# EAGLE design ECE445-Transmitter-Schematic (EAGLE 7.5.0)
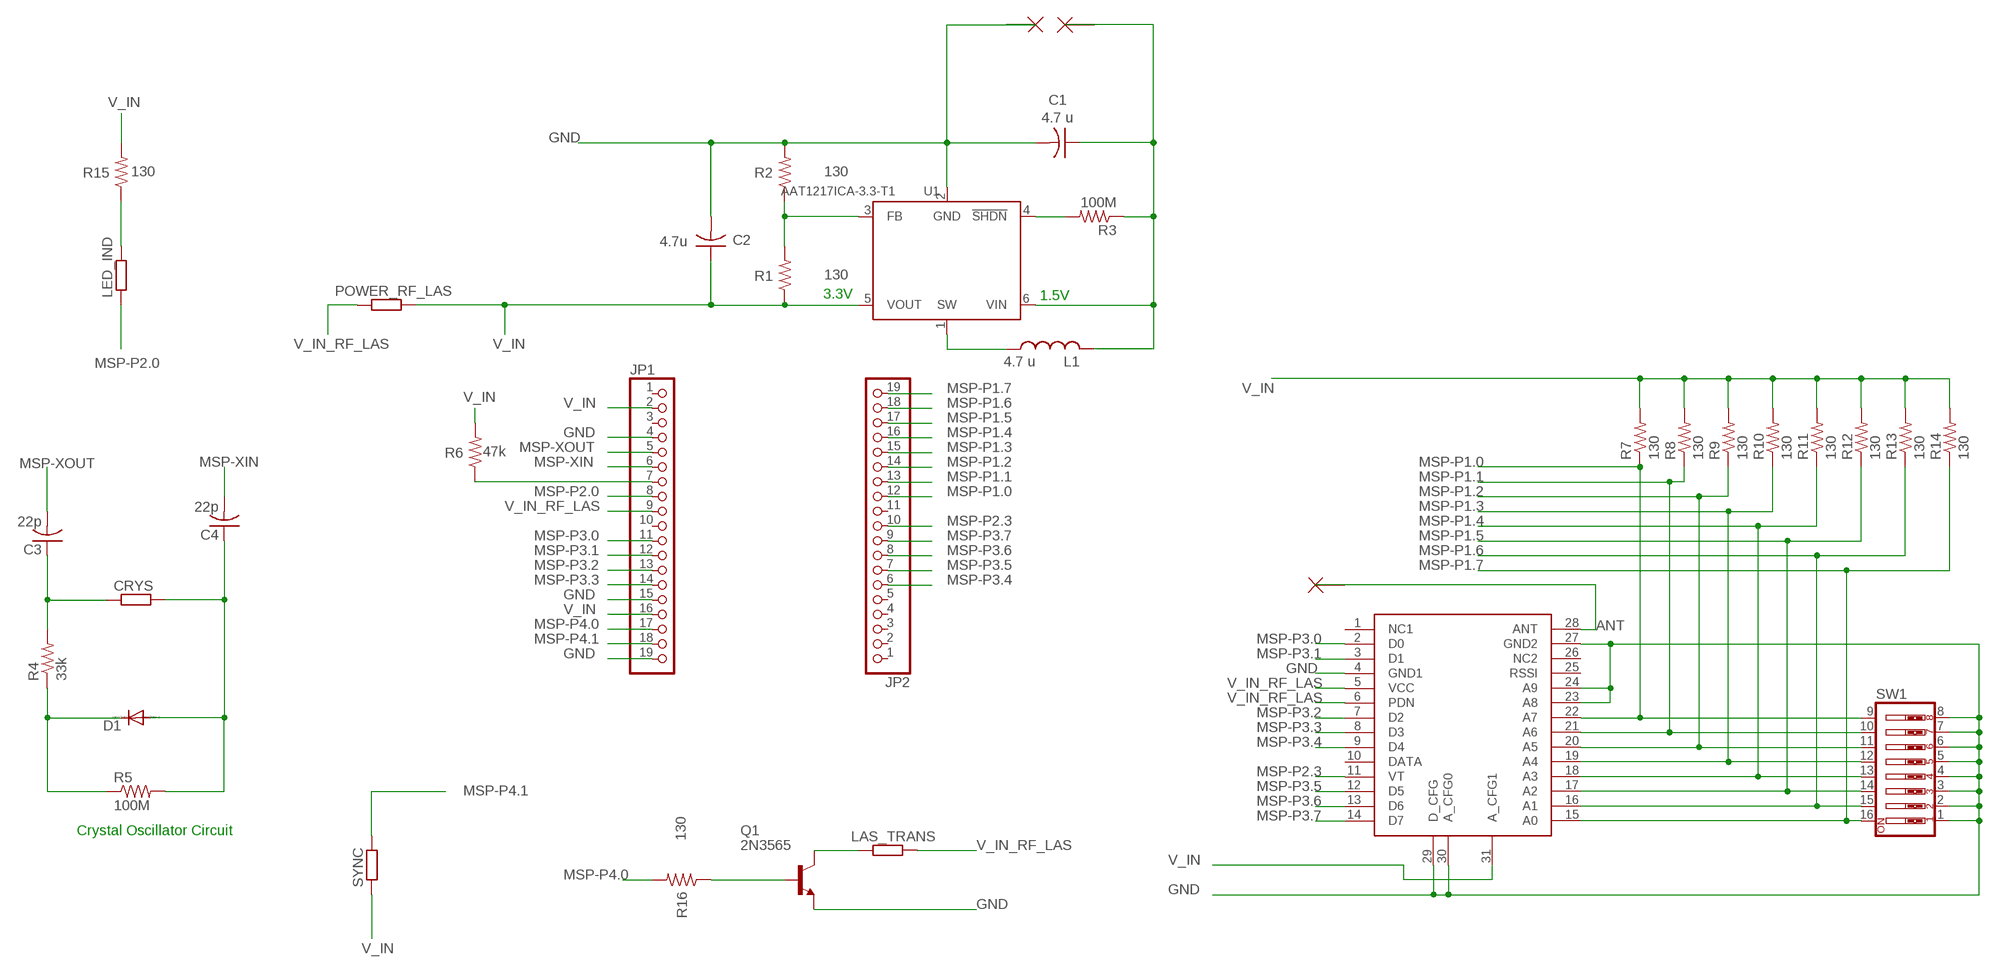
[diagram p0: schematic, sheet 1]

## Parts
C1  4.7 u  C-US025-024X044  [C025-024X044]
C2  4.7u  C-US025-024X044  [C025-024X044]
C3  22p  C-US025-024X044  [C025-024X044]
C4  22p  C-US025-024X044  [C025-024X044]
CRYS  R-EU_0204/5  [0204/5]
D1  1N4004  [DO41-10]
JP1  PINHD-1X19  [1X19]
JP2  PINHD-1X19  [1X19]
L1  4.7 u  L-US0204/5  [0204/5]
LAS_TRANS  R-EU_0204/5  [0204/5]
LED_IND  R-EU_0204/5  [0204/5]
POWER_RF_LAS  R-EU_0204/5  [0204/5]
Q1  2N3565  [TO92]
R1  130  R-US_0204/5  [0204/5]
R2  130  R-US_0204/5  [0204/5]
R3  100M  R-US_0204/2V  [0204V]
R4  33k  R-US_0204/2V  [0204V]
R5  100M  R-US_0204/2V  [0204V]
R6  47k  R-US_0204/5  [0204/5]
R7  130  R-US_0204/5  [0204/5]
R8  130  R-US_0204/5  [0204/5]
R9  130  R-US_0204/5  [0204/5]
R10  130  R-US_0204/5  [0204/5]
R11  130  R-US_0204/5  [0204/5]
R12  130  R-US_0204/5  [0204/5]
R13  130  R-US_0204/5  [0204/5]
R14  130  R-US_0204/5  [0204/5]
R15  130  R-US_0204/5  [0204/5]
R16  130  R-US_0204/5  [0204/5]
SW1  SW_DIP-8  [EDG-08]
SYNC  R-EU_0204/5  [0204/5]
U1  AAT1217ICA-3.3-T1  [TSOT-23-6]
U$1  KH3-RXM-LINX-315  [KH3-RXM-LINX-315]
U$2  NO_CONNECT  [NO_CONNECT]
U$3  NO_CONNECT  [NO_CONNECT]
U$4  NO_CONNECT  [NO_CONNECT]

## Nets
ANT: U$1.28(ANT) U$4.P$1(NC)
GND: C1.2 C2.2 JP1.4 JP1.15 JP1.19 Q1.3(E) R2.2 SW1.1 SW1.2 SW1.3 SW1.4 SW1.5 SW1.6 SW1.7 SW1.8 U1.2(GND) U$1.4(GND1) U$1.23(A8) U$1.24(A9) U$1.27(GND2) U$1.29(D_CFG) U$1.30(A_CFG0) U$2.P$1(NC)
MSP-P1.0: JP2.12 R7.1 SW1.9 U$1.22(A7)
MSP-P1.1: JP2.13 R8.1 SW1.10 U$1.21(A6)
MSP-P1.2: JP2.14 R9.1 SW1.11 U$1.20(A5)
MSP-P1.3: JP2.15 R10.1 SW1.12 U$1.19(A4)
MSP-P1.4: JP2.16 R11.1 SW1.13 U$1.18(A3)
MSP-P1.5: JP2.17 R12.1 SW1.14 U$1.17(A2)
MSP-P1.6: JP2.18 R13.1 SW1.15 U$1.16(A1)
MSP-P1.7: JP2.19 R14.1 SW1.16 U$1.15(A0)
MSP-P2.0: JP1.8 LED_IND.1
MSP-P2.3: JP2.10 U$1.11(VT)
MSP-P3.0: JP1.11 U$1.2(D0)
MSP-P3.1: JP1.12 U$1.3(D1)
MSP-P3.2: JP1.13 U$1.7(D2)
MSP-P3.3: JP1.14 U$1.8(D3)
MSP-P3.4: JP2.6 U$1.9(D4)
MSP-P3.5: JP2.7 U$1.12(D5)
MSP-P3.6: JP2.8 U$1.13(D6)
MSP-P3.7: JP2.9 U$1.14(D7)
MSP-P4.0: JP1.17 R16.2
MSP-P4.1: JP1.18 SYNC.2
MSP-XIN: C4.2 JP1.6
MSP-XOUT: C3.2 JP1.5
N$1: LAS_TRANS.1 Q1.1(C)
N$2: L1.1 U1.1(SW)
N$4: C1.1 L1.2 R3.1 U1.6(VIN) U$3.P$1(NC)
N$6: C3.1 CRYS.1 R4.2
N$7: Q1.2(B) R16.1
N$8: D1.C R4.1 R5.1
N$11: R1.2 R2.1 U1.3(FB)
N$12: C4.1 CRYS.2 D1.A R5.2
N$13: JP1.7 R6.1
N$19: R3.2 U1.4(!SHDN)
N$31: LED_IND.2 R15.1
V_IN: C2.1 JP1.2 JP1.16 POWER_RF_LAS.2 R1.1 R6.2 R7.2 R8.2 R9.2 R10.2 R11.2 R12.2 R13.2 R14.2 R15.2 SYNC.1 U1.5(VOUT) U$1.31(A_CFG1)
V_IN_RF_LAS: JP1.9 LAS_TRANS.2 POWER_RF_LAS.1 U$1.5(VCC) U$1.6(PDN)
Unconnected: JP1.1 JP1.3 JP1.10 JP2.1 JP2.2 JP2.3 JP2.4 JP2.5 JP2.11 U$1.1(NC1) U$1.10(DATA) U$1.25(RSSI) U$1.26(NC2)

## Notes on the sheet
- 3.3V | 1.5V
- Crystal Oscillator Circuit

## Library data of the parts
C1-C4 = rcl:C-US: CAPACITOR, American symbol
CRYS LAS_TRANS LED_IND POWER_RF_LAS SYNC = rcl:R-EU_: RESISTOR, European symbol
D1 = diode:1N4004: DIODE general purpose rectifier, 1 A
JP1 JP2 = pinhead:PINHD-1X19: PIN HEADER
L1 = rcl:L-US: INDUCTOR, American symbol
Q1 = transistor-npn:2N3565: NPN Transistor
R1-R16 = rcl:R-US_: RESISTOR, American symbol
SW1 = special:SW_DIP-8: DIP SWITCH
U1 = Skyworks:AAT1217
U$1 = KH3-RXM-LINX-315:KH3-RXM-LINX-315
U$2-U$4 = NO_CONNECT:NO_CONNECT

## Board
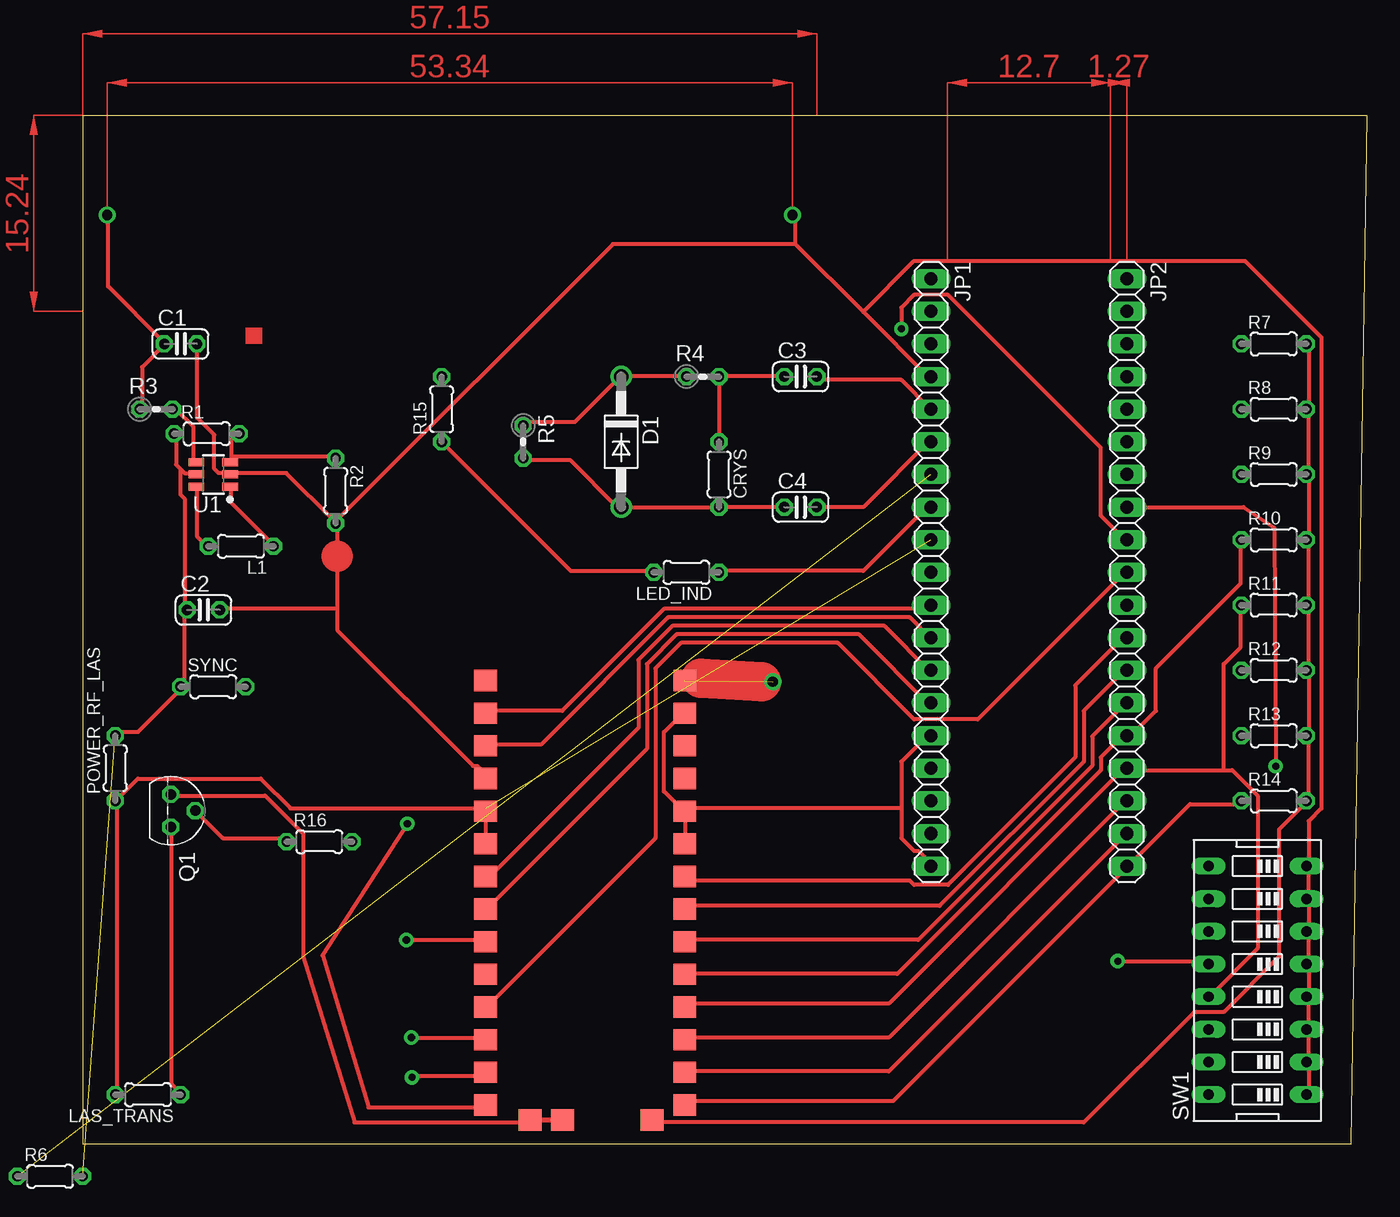
[diagram p1: board, top side]
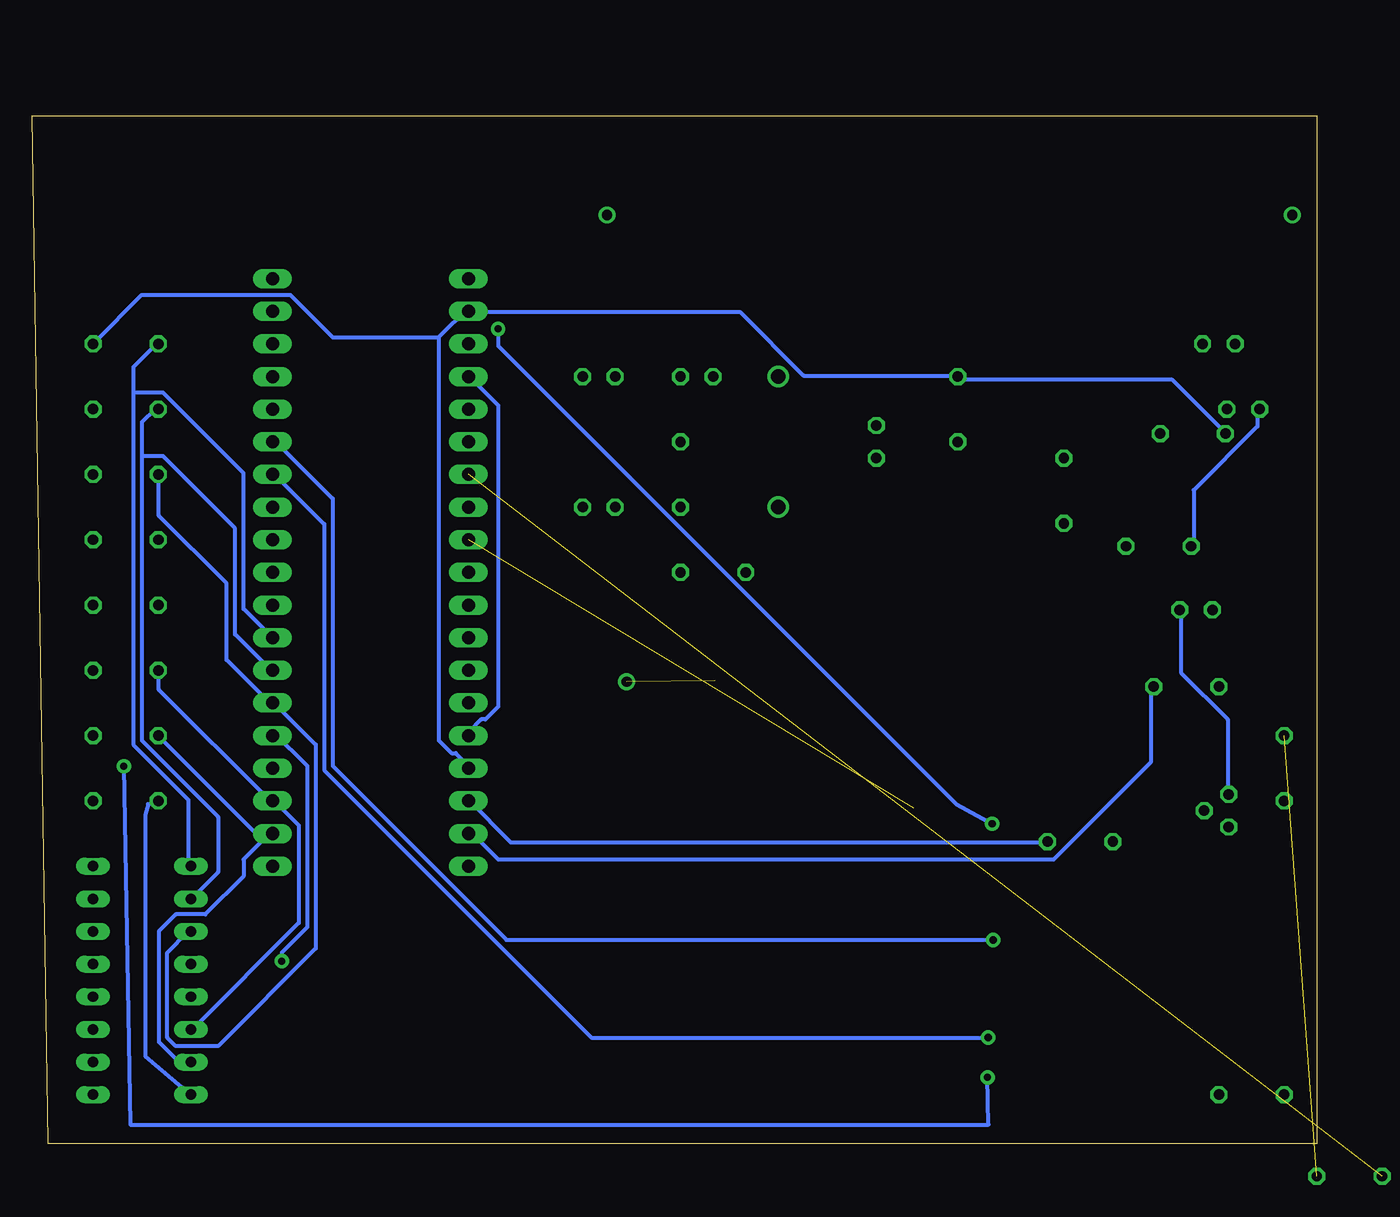
[diagram p2: board, bottom side, seen from below]

Size 100 x 80 mm. Coordinates in mm from the lower left corner, seen from the top.
Outline: 0,0 98.73,0 100,80 0,80 0,0
Copper layers (1*16): Top 0.035mm / dielectric 1.5mm / Bottom 0.035mm
Design rules "MWSEagleDesignRules2": minimum track width 13mil, minimum drill 22mil, track to track 13mil, track to pad 13mil, pad to pad 13mil, via to via 13mil, smd to smd 8mil, copper to edge 40mil, drill to drill 8mil, minimum pad ring 10mil, minimum via ring 8mil, stop-mask expansion 4mil, vias tented up to drill 0mil, thermal gap 10mil
vRestrict: area 0,64.8 to 57.1,80; area 31.9,2.5 to 47.1,36.8; area 88.3,1.3 to 94.6,24.1; area 67.3,20.3 to 80,68.6

### Footprints (pad centres in the part's own frame; a part is rotated, then mirrored left to right if it is on the bottom)
C025-024X044 = drill 0.813 octagon: 1 -1.27,0; 2 1.27,0
0204/5 = drill 0.813 octagon: 1 -2.54,0; 2 2.54,0
DO41-10 = drill 1.118: A 5.08,0; C -5.08,0
1X19 = drill 1.016 long: 1 -22.86,0; 2 -20.32,0; 3 -17.78,0; 4 -15.24,0; 5 -12.7,0; 6 -10.16,0; 7 -7.62,0; 8 -5.08,0; 9 -2.54,0; 10 0,0; 11 2.54,0; 12 5.08,0; 13 7.62,0; 14 10.16,0; 15 12.7,0; 16 15.24,0; 17 17.78,0; 18 20.32,0; 19 22.86,0
TO92 = drill 0.813 octagon: 1 1.27,0; 2 0,1.905; 3 -1.27,0
0204V = drill 0.813 octagon: 1 -1.27,0; 2 1.27,0
EDG-08 = drill 0.813 long: 1 -8.89,-3.81; 2 -6.35,-3.81; 3 -3.81,-3.81; 4 -1.27,-3.81; 5 1.27,-3.81; 6 3.81,-3.81; 7 6.35,-3.81; 8 8.89,-3.81; 9 8.89,3.81; 10 6.35,3.81; 11 3.81,3.81; 12 1.27,3.81; 13 -1.27,3.81; 14 -3.81,3.81; 15 -6.35,3.81; 16 -8.89,3.81
TSOT-23-6 = smd 1.22 x 0.62: 1 -1.31,0.95; 2 -1.31,0; 3 -1.31,-0.95; 4 1.31,-0.95; 5 1.31,0; 6 1.31,0.95
KH3-RXM-LINX-315 = smd 1.78 x 1.65: 1 -8,19.52; 2 -8,16.98; 3 -8,14.44; 4 -8,11.9; 5 -8,9.36; 6 -8,6.82; 7 -8,4.28; 8 -8,1.74; 9 -8,-0.8; 10 -8,-3.34; 11 -8,-5.88; 12 -8,-8.42; 13 -8,-10.96; 14 -8,-13.5; 15 7.49,-13.5; 16 7.49,-10.96; 17 7.49,-8.42; 18 7.49,-5.88; 19 7.49,-3.34; 20 7.49,-0.8; 21 7.49,1.74; 22 7.49,4.28; 23 7.49,6.82; 24 7.49,9.36; 25 7.49,11.9; 26 7.49,14.44; 27 7.49,16.98; 28 7.49,19.52; 29 -4.55,-14.67; 30 -2.01,-14.67; 31 4.95,-14.67
NO_CONNECT = drill 0.8: P$1 0,0

### Placement (x,y rotation side)
C1  7.62,62.23 0 top
C2  9.4,41.53 0 top
C3  55.88,59.69 0 top
C4  55.88,49.53 0 top
CRYS  49.53,52.07 270 top
D1  41.91,54.61 270 top
JP1  66.04,44.45 270 top
JP2  81.28,44.45 270 top
L1  12.32,46.48 180 top
LAS_TRANS  5.08,3.81 180 top
LED_IND  46.99,44.45 180 top
POWER_RF_LAS  2.54,29.21 90 top
Q1  6.86,25.91 270 top
R1  9.65,55.24 0 top
R2  19.68,50.8 270 top
R3  5.71,57.15 0 top
R4  48.26,59.69 0 top
R5  34.29,54.61 270 top
R6  -2.54,-2.54 0 top
R7  92.71,62.23 0 top
R8  92.71,57.15 0 top
R9  92.71,52.07 0 top
R10  92.71,46.99 0 top
R11  92.71,41.91 0 top
R12  92.71,36.83 0 top
R13  92.71,31.75 0 top
R14  92.71,26.67 0 top
R15  27.94,57.15 90 top
R16  18.41,23.5 0 top
SW1  91.44,12.7 90 top
SYNC  10.16,35.56 0 top
U1  10.16,52.07 180 top
U$1  39.37,16.51 0 top
U$2  55.24,72.26 0 top
U$3  1.91,72.26 0 top
U$4  53.72,35.94 0 top

### Tracks (layer width: path | path; a pad name or v marks a point on that pad's centre or on a via)
ANT  (1 unrouted)
GND
  Top 0.33: U$1.29 34.67,1.65 21.16,1.65 17.17,14.53 17.17,24.11 14.2,27.08 6.93,27.08 Q1.3 | R2.2 19.48,48.54 15.85,52.17 11.56,52.17 U1.2 11.23,52.17 10.57,52.17 10.24,52.5 10.24,55.14 8.91,56.46 8.91,62.08 C1.2 | 19.81,41.6 19.81,48.21 R2.2 | 19.81,41.6 19.81,39.95 30.38,29.39 30.71,29.39 31.37,28.73 U$1.4 | 19.81,41.6 10.9,41.6 C2.2 | U$1.23 46.89,23.44 46.89,25.76 U$1.24 | U$1.27 46.56,33.35 45.24,32.03 45.24,27.41 46.56,26.09 U$1.24 | 63.73,26.09 63.73,29.72 66.04,32.03 JP1.15 | 63.73,26.09 63.73,23.77 64.72,22.78 65.05,22.78 66.04,21.79 JP1.19 | 63.73,26.09 46.89,26.09 U$1.24 | 95.43,16.51 95.43,18.82 SW1.7 95.43,19.15 95.43,21.46 SW1.8 95.43,21.79 95.43,25.09 96.42,26.09 96.42,62.74 90.47,68.68 64.72,68.68 60.76,64.72 | SW1.1 95.43,3.96 95.43,6.27 SW1.2 95.43,6.6 95.43,8.59 SW1.3 95.43,8.91 95.43,11.23 SW1.4 95.43,11.56 95.43,13.87 SW1.5 95.43,14.2 95.43,16.51 | 95.43,16.51 SW1.6 | 55.47,70 55.47,71.98 U$2.P$1 | 60.76,64.72 66.04,59.44 JP1.4 | 60.76,64.72 55.47,70 | 55.47,70 41.27,70 19.81,48.54 R2.2
  Top 0.406: U$1.29 U$1.30
  Bottom 0.33: Q1.3 6.93,27.41 6.93,33.02 10.57,36.65 10.57,41.27 C2.2 | JP1.15 66.04,32.03 65.05,33.02 64.72,33.02 63.73,34.01 63.73,57.45 66.04,59.77 JP1.4
MSP-P1.0
  Top 0.33: U$1.22 46.89,20.47 64.39,20.47 64.72,20.14 67.36,20.14 77.27,30.05 77.27,35.66 81.23,39.62 JP2.12
  Bottom 0.33: 92.13,58.45 92.13,60.43 90.47,62.08 R7.1 | 92.13,58.45 92.13,31.04 87.83,26.75 87.83,21.79 SW1.9 | 92.13,58.45 89.81,58.45 83.54,52.17 83.54,41.6 81.56,39.62 JP2.12
MSP-P1.1
  Top 0.33: U$1.21 46.89,18.49 66.7,18.49 77.93,29.72 77.93,33.68 81.23,36.98 JP2.13
  Bottom 0.33: 91.47,53.49 91.47,56.13 90.47,57.12 R8.1 | 91.47,53.49 91.47,31.37 85.52,25.43 85.52,21.13 87.5,19.15 SW1.10 | 91.47,53.49 89.81,53.49 84.2,47.88 84.2,39.62 81.56,36.98 JP2.13
MSP-P1.2
  Top 0.33: U$1.20 46.89,15.85 65.05,15.85 78.59,29.39 78.59,31.7 81.23,34.34 JP2.14
  Bottom 0.33: SW1.11 87.83,16.51 89.48,14.86 89.48,8.26 88.82,7.59 85.52,7.59 77.93,15.19 77.93,31.04 81.23,34.34 JP2.14 81.56,34.34 84.86,37.64 84.86,43.59 90.14,48.87 90.14,51.84 R9.1
MSP-P1.3  (via drill 0.56)
  Top 0.33: U$1.19 46.89,13.21 63.4,13.21 79.25,29.06 79.25,30.05 81.23,32.03 JP2.15 81.56,31.7 83.54,33.68 83.54,36.98 90.14,43.59 90.14,46.89 R10.1 | v80.57,14.2 87.5,14.2 SW1.12
  Bottom 0.33: v80.57,14.2 80.57,14.86 78.59,16.84 78.59,29.39 81.23,32.03 JP2.15
MSP-P1.4
  Top 0.33: U$1.18 46.89,10.9 62.74,10.9 81.23,29.39 JP2.16 81.56,29.06 88.82,29.06 | 88.82,29.06 89.48,29.06 91.47,27.08 91.47,15.19 87.83,11.56 SW1.13 | 88.82,29.06 88.82,37.31 90.14,38.63 90.14,41.6 R11.1
MSP-P1.5
  Top 0.33: U$1.17 46.89,8.26 62.74,8.26 81.23,26.75 JP2.17
  Bottom 0.33: SW1.14 87.5,8.91 79.25,17.17 79.25,24.77 81.23,26.75 JP2.17 81.56,26.75 90.14,35.33 90.14,36.65 R12.1
MSP-P1.6
  Top 0.33: U$1.16 46.89,5.61 62.74,5.61 81.23,24.11 JP2.18
  Bottom 0.33: 81.89,23.77 81.56,24.11 JP2.18 81.89,23.77 | 81.89,23.77 83.54,22.12 83.54,20.8 86.51,17.83 88.82,17.83 90.14,16.51 90.14,7.92 88.82,6.6 87.83,6.6 SW1.15 | 81.89,23.77 82.22,23.77 90.14,31.7 R13.1
MSP-P1.7
  Top 0.33: U$1.15 46.89,3.3 63.07,3.3 81.23,21.46 JP2.19 81.56,21.79 86.18,26.42 90.14,26.42 R14.1
  Bottom 0.33: SW1.16 87.83,3.96 91.19,6.81 91.19,25.58 90.98,26.42 R14.1
MSP-P2.0
  Top 0.33: JP1.8 65.71,49.53 60.76,44.58 49.53,44.58 LED_IND.1
MSP-P2.3
  Top 0.33: U$1.11 31.7,10.9 44.58,23.77 44.58,36.98 46.56,38.96 58.78,38.96 64.72,33.02 69.67,33.02 81.23,44.58 JP2.10
MSP-P3.0
  Top 0.33: U$1.2 31.7,33.68 37.31,33.68 45.24,41.6 66.04,41.6 JP1.11
MSP-P3.1
  Top 0.33: U$1.3 31.7,31.04 35.66,31.04 45.57,40.95 64.39,40.95 66.04,39.29 JP1.12
MSP-P3.2
  Top 0.33: U$1.7 31.7,20.8 43.26,32.36 43.26,37.64 45.9,40.28 62.41,40.28 66.04,36.65 JP1.13
MSP-P3.3
  Top 0.33: U$1.8 31.7,18.49 43.92,30.71 43.92,37.31 46.23,39.62 60.43,39.62 66.04,34.01 JP1.14
MSP-P3.4  (via drill 0.56)
  Top 0.33: v25.2,15.85 31.37,15.85 U$1.9
  Bottom 0.33: v25.2,15.85 63.07,15.85 76.61,29.39 76.61,50.19 81.23,54.81 JP2.6
MSP-P3.5  (via drill 0.56)
  Top 0.33: v25.58,8.26 31.37,8.26 U$1.12
  Bottom 0.33: v25.58,8.26 56.46,8.26 77.27,29.06 77.27,48.21 81.23,52.17 JP2.7
MSP-P3.6  (via drill 0.56)
  Top 0.33: v25.63,5.16 25.63,5.28 31.7,5.28 U$1.13 | v92.86,29.36 92.73,47.93 90.37,49.53 JP2.8
  Bottom 0.33: v25.63,5.16 25.55,1.47 92.35,1.47 v92.86,29.36
MSP-P3.7  (via drill 0.56)
  Top 0.33: v25.27,24.89 18.67,14.66 22.25,2.82 30.58,2.82 31.37,3.3 U$1.14 | v63.73,63.4 63.73,65.05 64.72,66.04 67.36,66.04 79.25,54.15 79.25,48.87 81.23,46.89 JP2.9
  Bottom 0.33: v25.27,24.89 28.07,26.42 63.73,62.08 v63.73,63.4
MSP-P4.0
  Bottom 0.33: R16.2 21.13,23.44 62.74,23.44 66.04,26.75 JP1.17
MSP-P4.1
  Bottom 0.33: SYNC.2 12.88,35.33 12.88,29.72 20.47,22.12 63.73,22.12 66.04,24.43 JP1.18
MSP-XIN
  Top 0.33: C4.2 60.76,49.53 66.04,54.81 JP1.6
MSP-XOUT
  Top 0.33: C3.2 57.45,59.44 63.73,59.44 66.04,57.12 JP1.5
N$1
  Top 0.33: Q1.1 6.93,24.43 6.93,4.62 7.59,3.96 LAS_TRANS.1
N$2
  Top 0.33: U1.1 11.56,50.85 11.56,49.86 14.86,46.56 L1.1
N$4
  Top 0.33: U1.6 8.91,50.85 8.91,47.22 9.58,46.56 L1.2 | U$3.P$1 1.98,71.98 1.98,66.7 6.27,62.41 C1.1 6.27,62.08 4.62,60.43 4.62,57.45 R3.1
  Bottom 0.33: L1.2 9.58,46.56 9.58,50.85 4.62,55.8 4.62,57.12 R3.1
N$6
  Top 0.33: CRYS.1 R4.2 49.53,59.77 54.48,59.77 C3.1
N$7
  Top 0.33: Q1.2 10.9,23.77 15.85,23.77 R16.1
N$8
  Top 0.33: R5.1 34.34,56.13 38.3,56.13 41.6,59.44 D1.C 41.94,59.77 46.89,59.77 R4.1
N$10
  Top 3.09: 48.13,36.2 52.83,35.94
N$11
  Top 0.33: 11.56,53.49 11.56,54.81 11.89,55.14 R1.2 | 11.56,53.49 11.56,53.16 U1.3 | 11.56,53.49 19.48,53.49 R2.1
N$12
  Top 0.33: C4.1 CRYS.2 D1.A 41.6,49.53 37.97,53.16 34.34,53.16 R5.2
N$13  (1 unrouted)
N$19
  Top 0.33: U1.4 8.59,53.16 8.59,55.8 7.26,57.12 R3.2
N$31
  Top 0.33: R15.1 37.97,44.58 44.25,44.58 LED_IND.2
V_IN  (1 unrouted)
  Top 0.33: POWER_RF_LAS.2 2.64,32.03 4.29,32.03 7.59,35.33 SYNC.1 7.92,35.66 7.92,41.27 C2.1 7.92,41.6 7.92,50.19 7.59,50.52 7.59,52.5 | 7.59,52.5 7.26,52.83 7.26,55.14 R1.1 | 7.59,52.5 7.92,52.17 8.59,52.17 U1.5 | R7.2 95.43,62.08 95.43,57.45 R8.2 95.43,57.12 95.43,52.17 R9.2 95.43,51.84 95.43,47.22 R10.2 95.43,46.89 95.43,41.94 R11.2 95.43,41.6 95.43,36.98 R12.2 95.43,36.65 95.43,32.03 R13.2 95.43,31.7 95.43,26.75 R14.2 95.1,26.42 93.12,24.43 93.12,14.53 88.82,10.24 86.51,10.24 77.93,1.65 44.58,1.65 U$1.31
  Bottom 0.33: R1.1 7.26,55.47 11.23,59.44 27.74,59.44 R15.2 28.07,59.77 39.95,59.77 44.91,64.72 66.04,64.72 JP1.2 66.04,65.05 68.35,62.74 | 68.35,62.74 68.35,31.37 67.36,30.38 67.03,30.38 66.04,29.39 JP1.16 | 68.35,62.74 76.61,62.74 79.91,66.04 91.47,66.04 95.1,62.41 R7.2
V_IN_RF_LAS  (1 unrouted)
  Top 0.33: U$1.6 31.37,23.44 31.37,25.76 U$1.5 31.37,26.09 16.18,26.09 13.87,28.4 4.29,28.4 2.64,26.75 POWER_RF_LAS.1 2.64,26.42 2.64,3.96 LAS_TRANS.2
(copper drawn outside any net)
  shapes: Top area x6, Top circle x1